# EAGLE design DSO_Expendr1_0 (EAGLE 9.2.1)

## Sheet 1 of 3
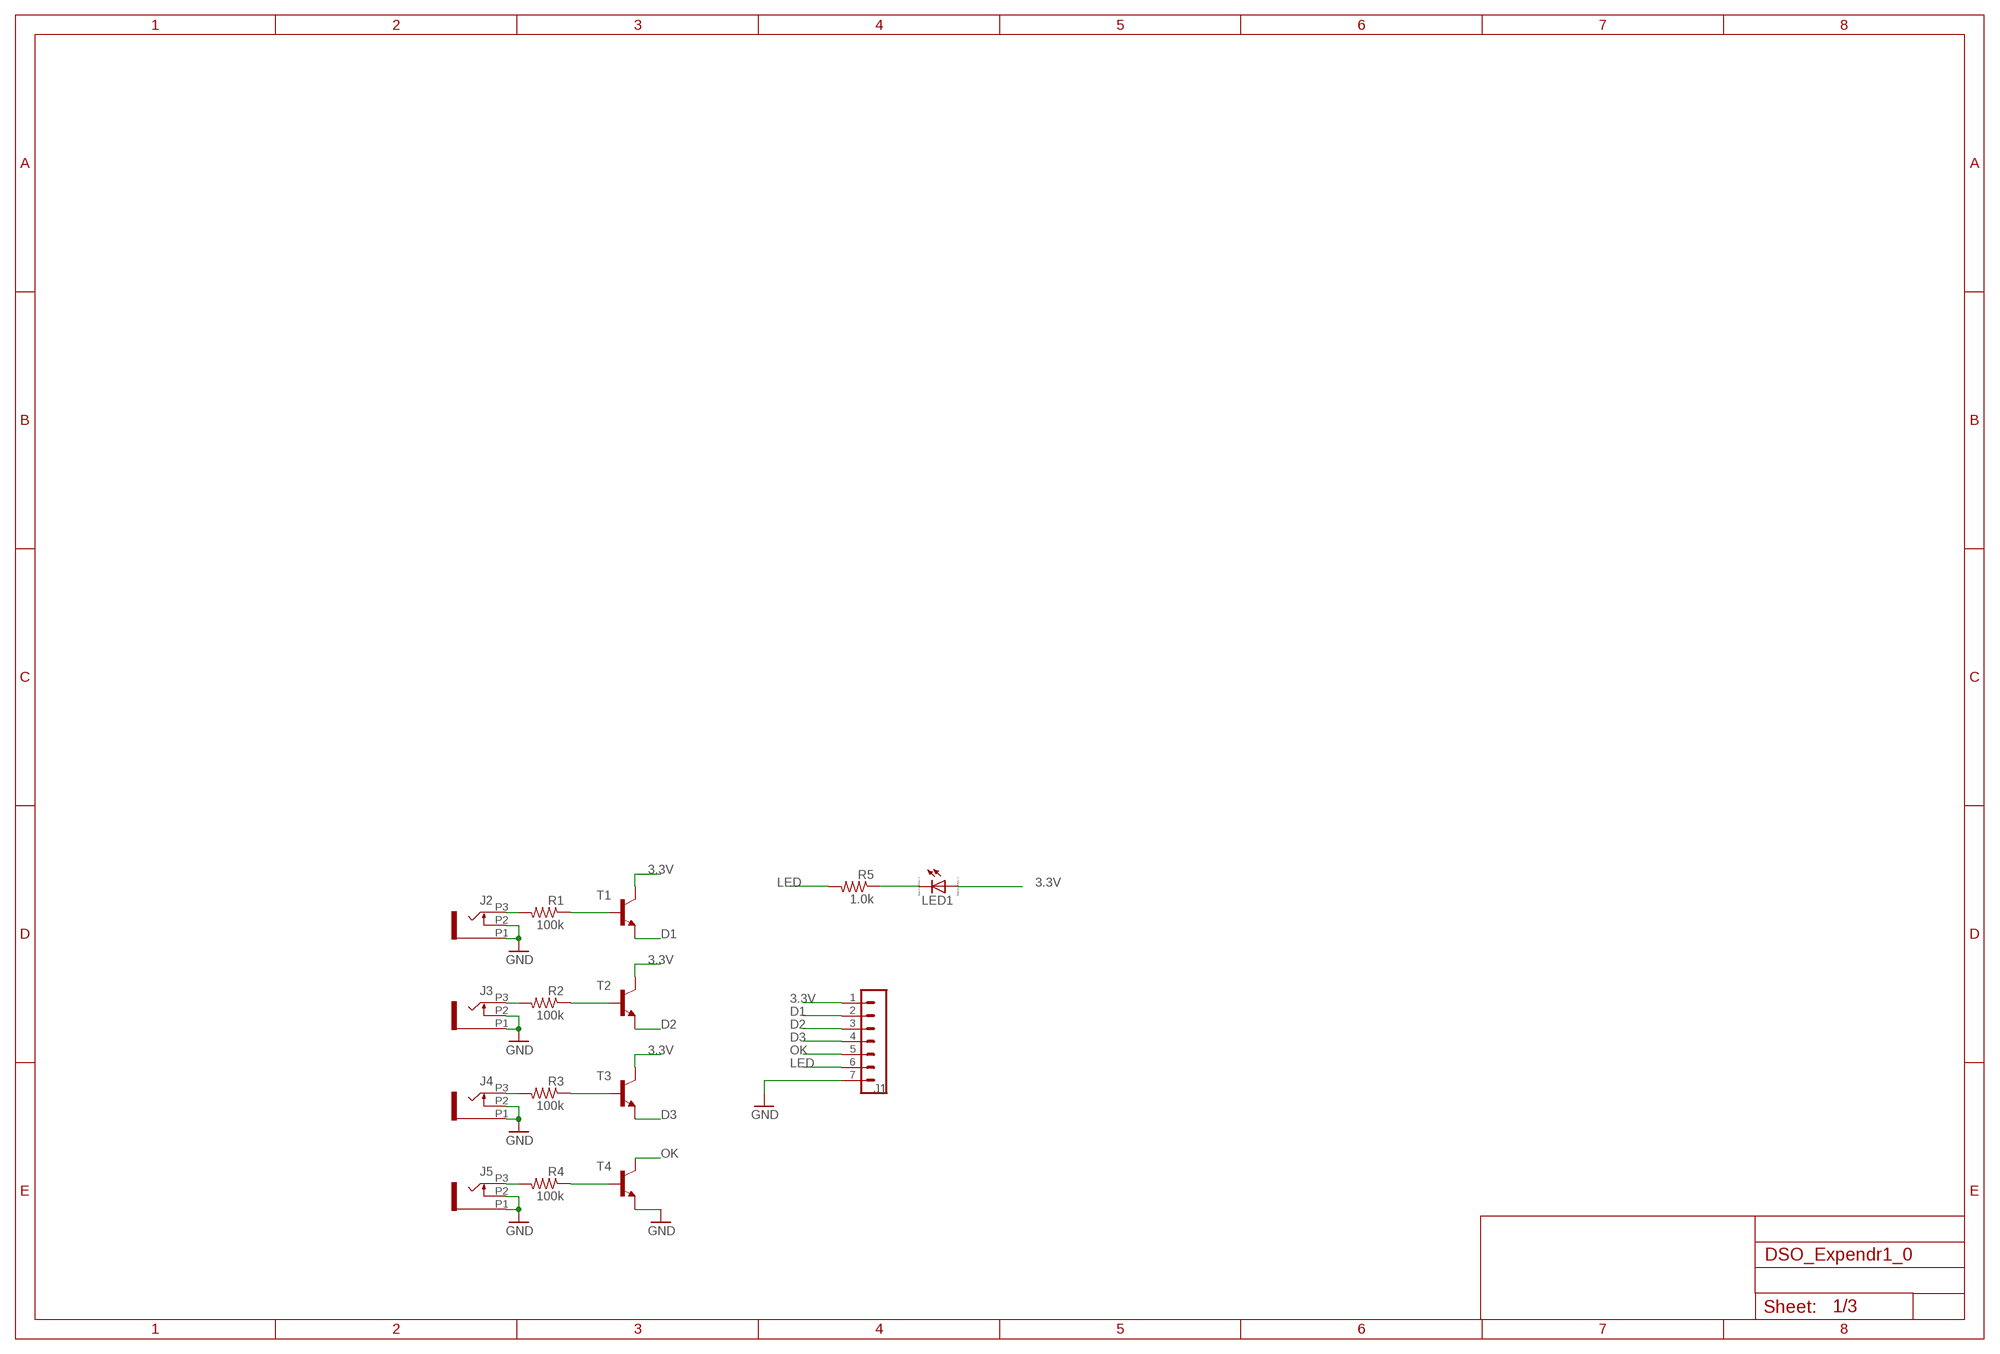
[diagram p0: schematic, sheet 1]

### Parts
J1  MA07-1  [MA07-1]
J2  OG-PJ301_PJ301_THONKICONN  [OG-PJ301_WQP_PJ_301M6_NO_HOLE]
J3  OG-PJ301_PJ301_THONKICONN  [OG-PJ301_WQP_PJ_301M6_NO_HOLE]
J4  OG-PJ301_PJ301_THONKICONN  [OG-PJ301_WQP_PJ_301M6_NO_HOLE]
J5  OG-PJ301_PJ301_THONKICONN  [OG-PJ301_WQP_PJ_301M6_NO_HOLE]
LED1  LED_E  [LED_1206]
R1  100k  R-US_R0805  [R0805]
R2  100k  R-US_R0805  [R0805]
R3  100k  R-US_R0805  [R0805]
R4  100k  R-US_R0805  [R0805]
R5  1.0k  R-US_R0805  [R0805]
T1  MMBT3904LT1-NPN-SOT23-BEC  [SOT23-BEC]
T2  MMBT3904LT1-NPN-SOT23-BEC  [SOT23-BEC]
T3  MMBT3904LT1-NPN-SOT23-BEC  [SOT23-BEC]
T4  MMBT3904LT1-NPN-SOT23-BEC  [SOT23-BEC]

### Nets
3.3V: J1.1 LED1.A T1.C T2.C T3.C
D1: J1.2 T1.E
D2: J1.3 T2.E
D3: J1.4 T3.E
GND: J1.7 J2.P1 J2.P2 J3.P1 J3.P2 J4.P1 J4.P2 J5.P1 J5.P2 T4.E
LED: J1.6 R5.2
N$1: J2.P3 R1.2
N$2: R1.1 T1.B
N$3: J3.P3 R2.2
N$4: R2.1 T2.B
N$5: J4.P3 R3.2
N$6: R3.1 T3.B
N$7: J5.P3 R4.2
N$8: R4.1 T4.B
N$10: LED1.C R5.1
OK: J1.5 T4.C

## Sheet 2 of 3

## Sheet 3 of 3

## Library data of the parts
J1 = con-lstb:MA07-1: PIN HEADER; OC_FARNELL: unknown; OC_NEWARK: unknown
J2-J5 = SHAY_THONKICONNS:OG-PJ301_PJ301_THONKICONN
LED1 = eagle-ltspice:LED_E: LED Source: http://www.osram.convergy.de Source: www.luxeon.com Source: www.kingbright.com; SPICEMODEL: NONE; SPICEPREFIX: D; SPICETYPE: diode
R1-R5 = rcl:R-US_: RESISTOR, American symbol; SPICEPREFIX: R
T1-T4 = transistor:*-NPN-: NPN Transistror BF959 corrected 2008.03.06

## Board
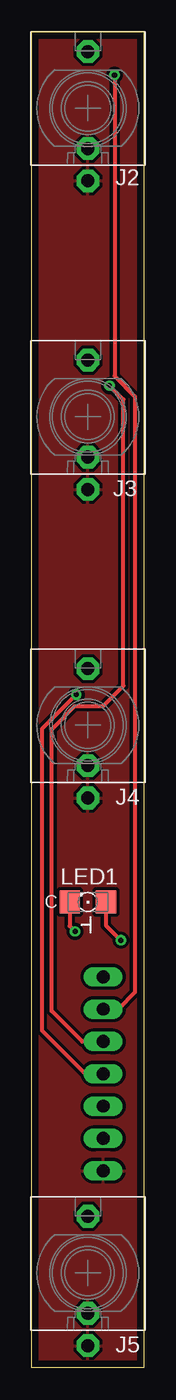
[diagram p1: board, top side]
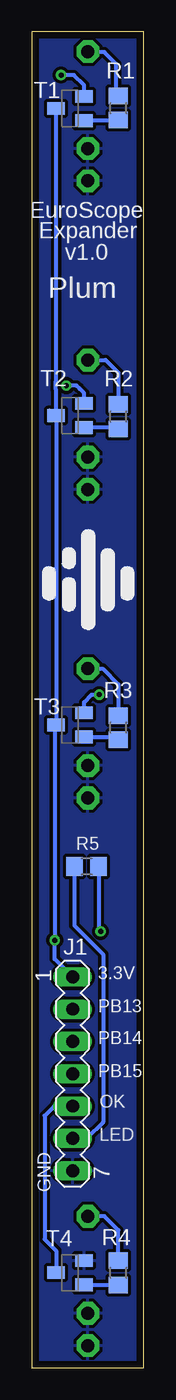
[diagram p2: board, bottom side, seen from below]

Size 8.8 x 105 mm. Coordinates in mm from the lower left corner, seen from the top.
Outline: 8.8,0 0,0 0,105 8.8,105 8.8,0
Copper layers (1*16): Top 0.035mm / dielectric 0.15mm / Bottom 0.035mm
Design rules "default *": minimum track width 10mil, minimum drill 0.4mm, track to track 10mil, track to pad 10mil, pad to pad 10mil, via to via 10mil, smd to smd 10mil, copper to edge 20mil, drill to drill 6mil, minimum pad ring 10mil, minimum via ring 8mil, stop-mask expansion 6mil, vias tented up to drill 25mil, thermal gap 10mil

### Footprints (pad centres in the part's own frame; a part is rotated, then mirrored left to right if it is on the bottom)
MA07-1 = drill 1.016 long: 1 -7.62,0; 2 -5.08,0; 3 -2.54,0; 4 0,0; 5 2.54,0; 6 5.08,0; 7 7.62,0
OG-PJ301_WQP_PJ_301M6_NO_HOLE = drill 1.016 pad 1.778 octagon: P1 0,-5.715; P2 0,-3.175; P3 0,4.445
LED_1206 = smd 1.6 x 1.803: A -1.422,0; C 1.422,0
R0805 = smd 1.3 x 1.5: 1 -0.95,0; 2 0.95,0
SOT23-BEC = smd 1 x 1.4: B -0.95,-1.1; C 0,1.1; E 0.95,-1.1

### Placement (x,y rotation side)
J1  5.6,23.1 270 bottom
J2  4.4,99 0 top
J3  4.4,74.75 0 top
J4  4.4,50.5 0 top
J5  4.4,7.45 0 top
LED1  4.4,36.6 180 top
R1  2,99.01 90 bottom
R2  2,74.76 90 bottom
R3  2,50.31 90 bottom
R4  2,7.46 90 bottom
R5  4.5,39.4 180 bottom
T1  5.8,98.97 90 bottom
T2  5.8,74.84 90 bottom
T3  5.8,50.52 90 bottom
T4  5.8,7.47 90 bottom

### Tracks (layer width: path | path; a pad name or v marks a point on that pad's centre or on a via)
3.3V  (via drill 0.4)
  Top 0.305: LED1.A 5.82,34.78 v7,33.6
  Bottom 0.305: 7.43,75.24 T2.C | 7.43,50.72 T3.C | T2.C T3.C | T2.C 6.9,76.86 6.91,76.86 6.91,77.53 6.9,77.55 T1.C | 5.4,30.92 J1.1 7,32.12 v7,33.6 7,50.42 T3.C
D1  (via drill 0.4)
  Top 0.305: v6.5,101.6 6.5,77.94 8.1,76.34 8.1,29.5 6.78,28.18 J1.2
  Bottom 0.305: v6.5,101.6 5.5,101.6 4.7,100.8 T1.E
D2  (via drill 0.4)
  Top 0.305: v6.1,77.2 7.2,76.1 7.2,53.6 5.6,52 3.39,52 1.56,50.17 1.56,28.04 3.96,25.64 J1.3
  Bottom 0.305: T2.E 4.7,76.6 5.05,76.95 5.3,77.2 v6.1,77.2
D3  (via drill 0.4)
  Top 0.305: v3.5,52.9 0.8,50.2 0.8,26.5 4.2,23.1 J1.4
  Bottom 0.305: v3.5,52.9 4.1,52.9 4.7,52.3 T3.E
GND
  pour Top: 8.8,105 8.8,0 0,0 0,105
  pour Bottom: 8.8,105 8.8,0 0,0 0,105
LED
  Bottom 0.305: R5.2 5.45,34.75 3.2,32.5 3.2,19.3 4.48,18.02 J1.6
N$1
  Bottom 0.305: R1.2 2.16,99.96 2.16,102.46 3.1,103.4 4.36,103.4 J2.P3
N$2
  Bottom 0.305: T1.B 4.64,98.06 R1.1
N$3
  Bottom 0.305: J3.P3 3,79.19 2,78.2 R2.2
N$4
  Bottom 0.305: R2.1 2.09,73.89 T2.B
N$5
  Bottom 0.305: R3.2 2,53.7 3.25,54.95 J4.P3
N$6
  Bottom 0.305: T3.B 2.56,49.57 R3.1
N$7
  Bottom 0.305: 1.8,8.66 R4.2 2,10.8 3.1,11.9 3.1,11.89 J5.P3
N$8
  Bottom 0.305: T4.B R4.1
N$10  (via drill 0.4)
  Top 0.305: LED1.C 2.98,34.72 v3.4,34.3
  Bottom 0.305: R5.1 3.55,34.45 v3.4,34.3
OK
  Bottom 0.305: T4.C 6.9,9.2 7.8,10.1 7.8,19.8 7.04,20.56 J1.5

### Text on the board
tPlace: C
bPlace: EuroScope | Expander | v1.0 | Plum | 3.3V | PB13 | PB14 | PB15 | OK | LED | GND
bValues: 3904 | 3904 | 3904 | 3904